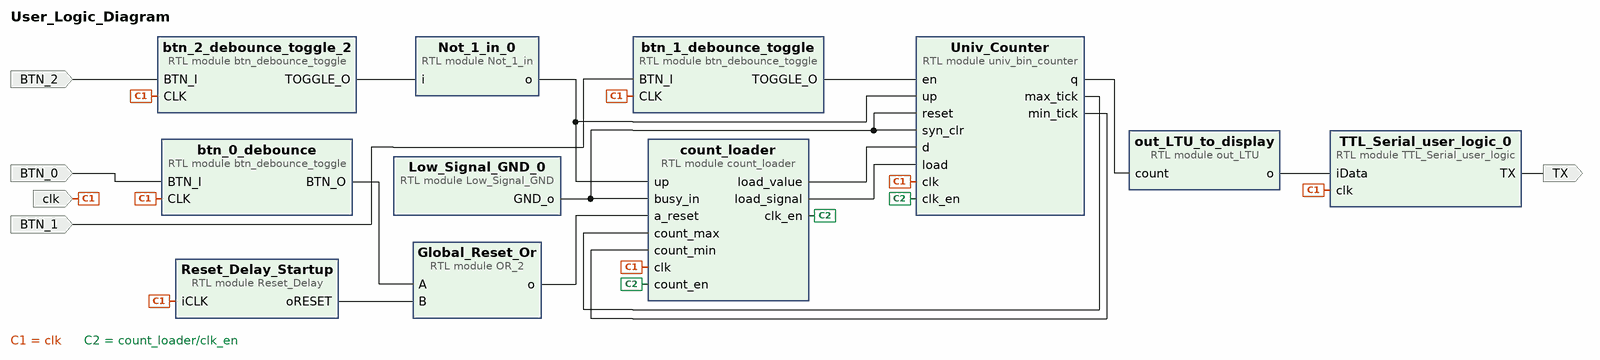
[diagram p0: block diagram of the top level]
# Vivado block design User_Logic_Diagram, xc7z010clg225-1, Vivado 2019.1
create_bd_design User_Logic_Diagram

create_bd_port -dir I BTN_0
create_bd_port -dir I BTN_1
create_bd_port -dir I BTN_2
create_bd_port -dir I clk
create_bd_port -dir O TX

create_bd_cell -type module -reference OR_2 Global_Reset_Or
create_bd_cell -type module -reference Low_Signal_GND Low_Signal_GND_0
create_bd_cell -type module -reference Not_1_in Not_1_in_0
create_bd_cell -type module -reference Reset_Delay Reset_Delay_Startup
set_property -dict {CONFIG.MAX 20} [get_bd_cells Reset_Delay_Startup]
create_bd_cell -type module -reference univ_bin_counter Univ_Counter
set_property -dict {CONFIG.N 8} [get_bd_cells Univ_Counter]
create_bd_cell -type module -reference btn_debounce_toggle btn_0_debounce
set_property -dict {CONFIG.CNTR_MAX 0x0002} [get_bd_cells btn_0_debounce]
create_bd_cell -type module -reference btn_debounce_toggle btn_1_debounce_toggle
set_property -dict {CONFIG.CNTR_MAX 0x0002} [get_bd_cells btn_1_debounce_toggle]
create_bd_cell -type module -reference btn_debounce_toggle btn_2_debounce_toggle_2
set_property -dict {CONFIG.CNTR_MAX 0x0002} [get_bd_cells btn_2_debounce_toggle_2]
create_bd_cell -type module -reference count_loader count_loader
set_property -dict {CONFIG.clk_en_max_count 5 CONFIG.d_size 8} [get_bd_cells count_loader]
create_bd_cell -type module -reference out_LTU out_LTU_to_display
set_property -dict {CONFIG.out_size 16} [get_bd_cells out_LTU_to_display]
create_bd_cell -type module -reference TTL_Serial_user_logic TTL_Serial_user_logic_0

# ---- connections ----

connect_bd_net -net BTN_0_input [get_bd_ports BTN_0] [get_bd_pins btn_0_debounce/BTN_I]
connect_bd_net -net BTN_1_input [get_bd_ports BTN_1] [get_bd_pins btn_1_debounce_toggle/BTN_I]
connect_bd_net -net BTN_2_input [get_bd_ports BTN_2] [get_bd_pins btn_2_debounce_toggle_2/BTN_I]
connect_bd_net -net Clock_50 [get_bd_ports clk] \
  [get_bd_pins Univ_Counter/clk] [get_bd_pins Reset_Delay_Startup/iCLK] [get_bd_pins count_loader/clk] \
  [get_bd_pins btn_0_debounce/CLK] [get_bd_pins btn_1_debounce_toggle/CLK] [get_bd_pins btn_2_debounce_toggle_2/CLK] \
  [get_bd_pins TTL_Serial_user_logic_0/clk]
connect_bd_net -net Counter_Value [get_bd_pins Univ_Counter/q] [get_bd_pins out_LTU_to_display/count]
connect_bd_net -net Global_Reset [get_bd_pins Global_Reset_Or/o] [get_bd_pins count_loader/a_reset]
connect_bd_net -net Low_Signal_GND_0_GND [get_bd_pins Low_Signal_GND_0/GND_o] \
  [get_bd_pins Univ_Counter/reset] [get_bd_pins Univ_Counter/syn_clr] [get_bd_pins count_loader/busy_in]
connect_bd_net -net Reset_Delay_o [get_bd_pins Reset_Delay_Startup/oRESET] [get_bd_pins Global_Reset_Or/B]
connect_bd_net [get_bd_pins btn_2_debounce_toggle_2/TOGGLE_O] [get_bd_pins Not_1_in_0/i]
connect_bd_net -net clock_en [get_bd_pins count_loader/clk_en] [get_bd_pins Univ_Counter/clk_en] [get_bd_pins count_loader/count_en]
connect_bd_net -net count_loade_value [get_bd_pins count_loader/load_value] [get_bd_pins Univ_Counter/d]
connect_bd_net [get_bd_pins count_loader/load_signal] [get_bd_pins Univ_Counter/load]
connect_bd_net -net debounce_direction_TOGGLE [get_bd_pins Not_1_in_0/o] [get_bd_pins Univ_Counter/up] [get_bd_pins count_loader/up]
connect_bd_net -net enable_toggle [get_bd_pins btn_1_debounce_toggle/TOGGLE_O] [get_bd_pins Univ_Counter/en]
connect_bd_net -net initializer_pre_debounce [get_bd_pins btn_0_debounce/BTN_O] [get_bd_pins Global_Reset_Or/A]
connect_bd_net -net univ_bin_counter_max_tick [get_bd_pins Univ_Counter/max_tick] [get_bd_pins count_loader/count_max]
connect_bd_net -net univ_bin_counter_min_tick [get_bd_pins Univ_Counter/min_tick] [get_bd_pins count_loader/count_min]
connect_bd_net [get_bd_pins out_LTU_to_display/o] [get_bd_pins TTL_Serial_user_logic_0/iData]
connect_bd_net [get_bd_pins TTL_Serial_user_logic_0/TX] [get_bd_ports TX]

validate_bd_design
save_bd_design
